# Altium schematic sheet Top Layer.SchDoc
size 508 x 508 mm; SPICEModelCacheOYVUHRHD: <root> / <DocumentId>OYVUHRHD</DocumentId> / <CacheFrame Number="0"> / <Model Name="zener" Kind="MDL"> / <Text>*ZENER / *Default Zener 10V @ 10mA / *Zener Diode Pinout: A,K / .MODEL ZENER D( BV=10 IBV=10E-3 )</Text> / </Model> / <Model Name="cap" Kind="MDL"> / <Text>*Default semiconductor capacitor / .MODEL CAP C()</Text> / </Model> / </CacheFrame> / </root>
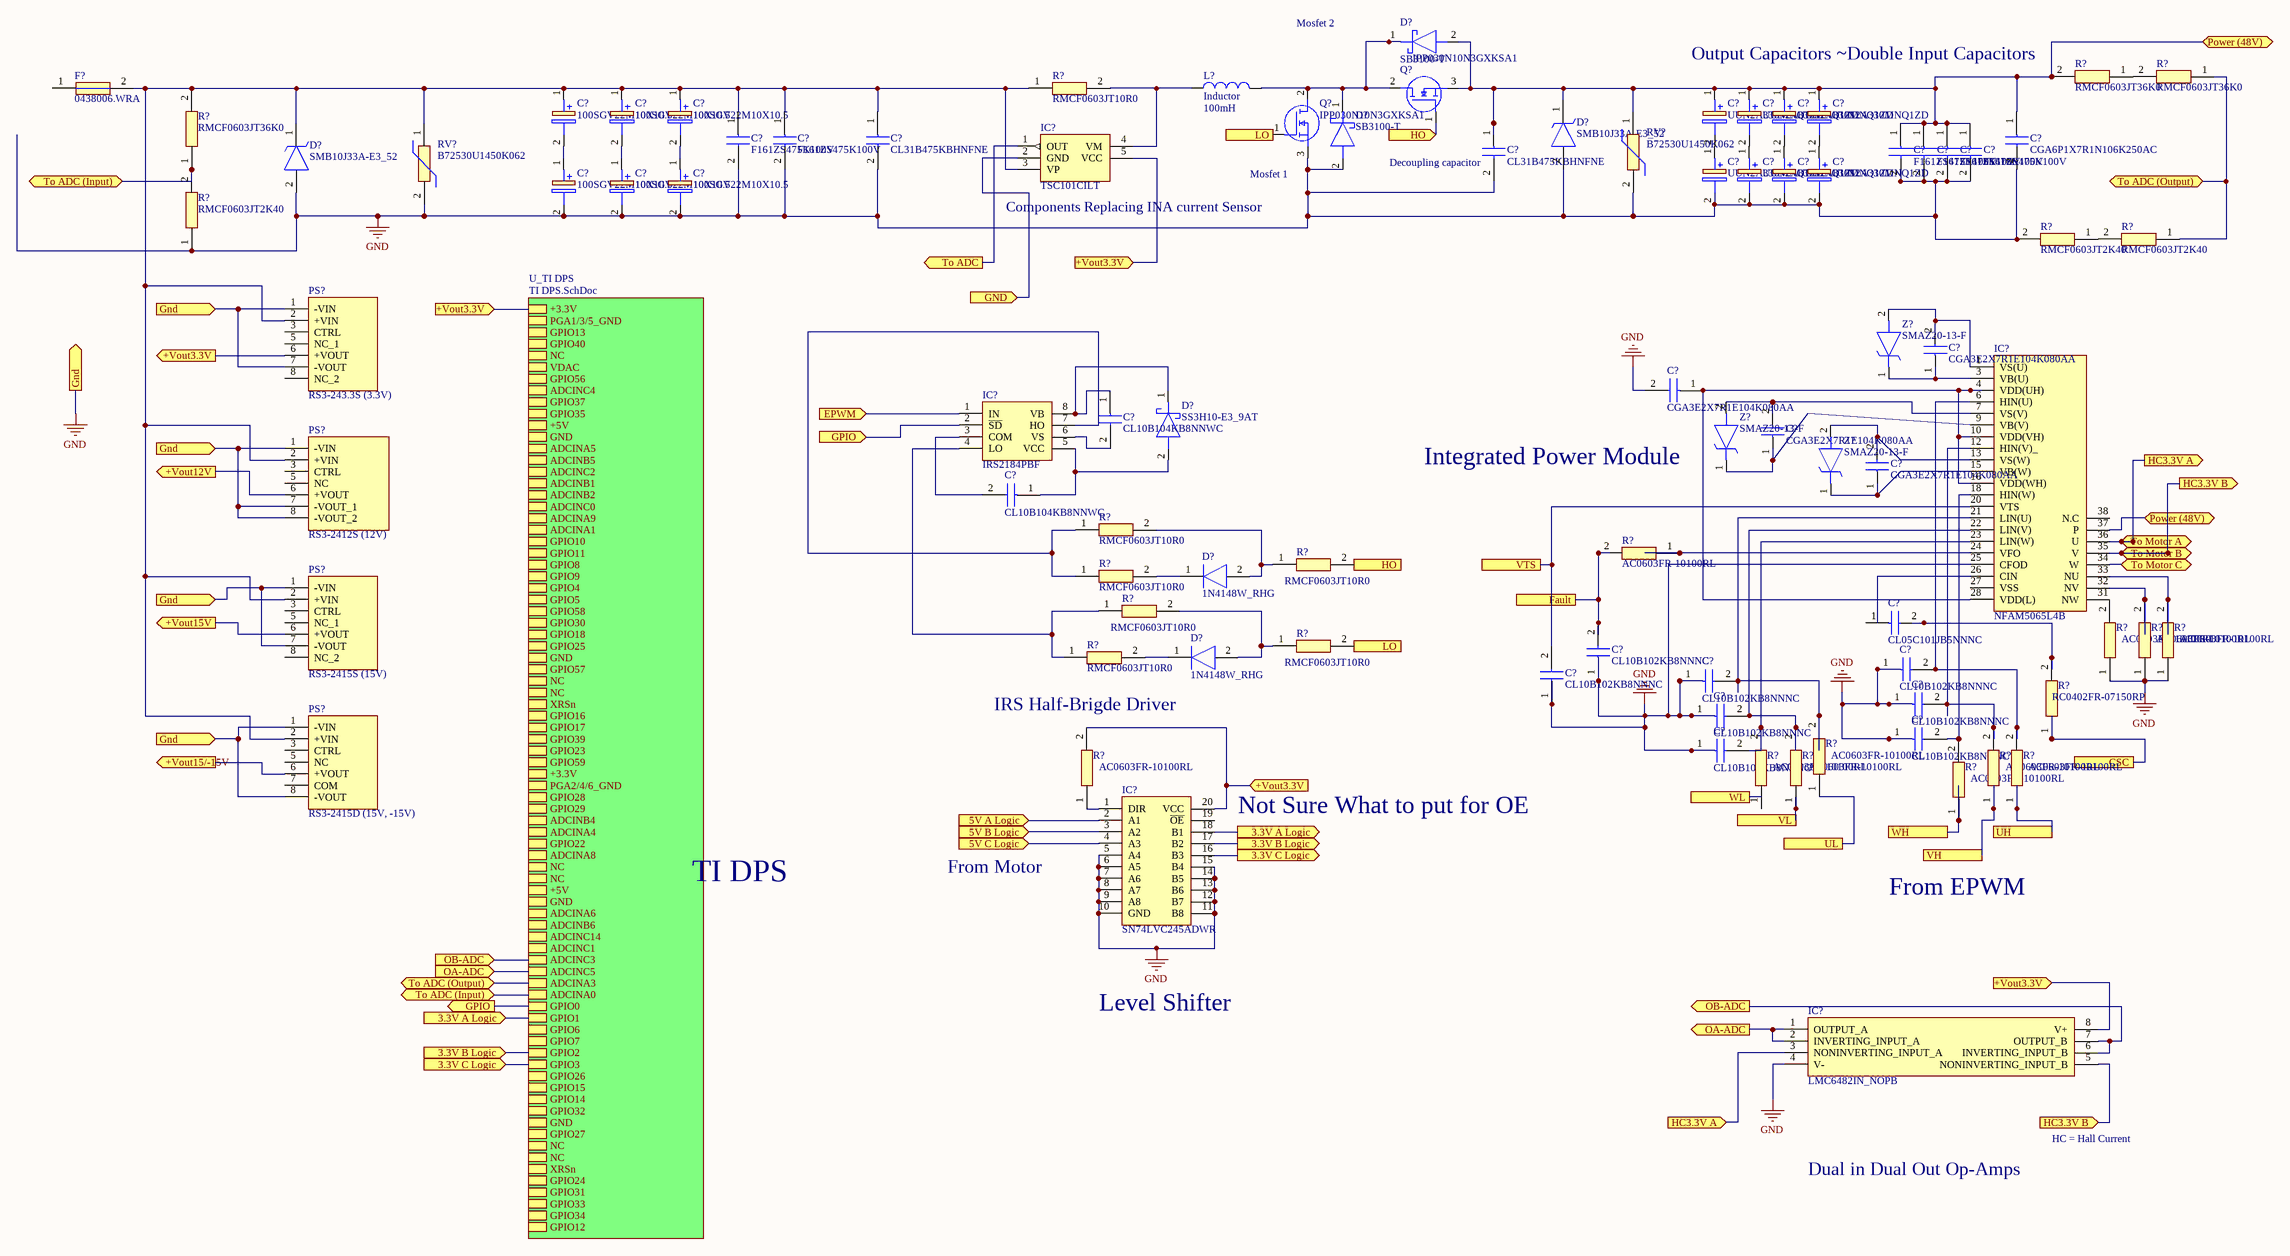
[diagram p0: Top Layer.SchDoc]

## Parts
(Parts that share a designator on the sheet are numbered #1, #2 ... from top to bottom, then left to right.)
C?#1  100SGV22M10X10.5  [CAPAE1030X1050N]
C?#2  100SGV22M10X10.5  [CAPAE1030X1050N]
C?#3  100SGV22M10X10.5  [CAPAE1030X1050N]
C?#4  UUN2A330MNQ1ZD  [CAPAE1360X1700N]
C?#5  UUN2A330MNQ1ZD  [CAPAE1360X1700N]
C?#6  UUN2A330MNQ1ZD  [CAPAE1360X1700N]
C?#7  UUN2A330MNQ1ZD  [CAPAE1360X1700N]
C?#8  F161ZS475K100V  [CAPC165150X720N]
C?#9  F161ZS475K100V  [CAPC165150X720N]
C?#10  CL31B475KBHNFNE  [CAPC3216X180N]
C?#11  CGA6P1X7R1N106K250AC  [CAPC3225X280N]
C?#12  CL31B475KBHNFNE  [CAPC3216X180N]
C?#13  F161ZS475K100V  [CAPC165150X720N]
C?#14  F161ZS475K100V  [CAPC165150X720N]
C?#15  F161ZS475K100V  [CAPC165150X720N]
C?#16  F161ZS475K100V  [CAPC165150X720N]
C?#17  UUN2A330MNQ1ZD  [CAPAE1360X1700N]
C?#18  UUN2A330MNQ1ZD  [CAPAE1360X1700N]
C?#19  UUN2A330MNQ1ZD  [CAPAE1360X1700N]
C?#20  UUN2A330MNQ1ZD  [CAPAE1360X1700N]
C?#21  100SGV22M10X10.5  [CAPAE1030X1050N]
C?#22  100SGV22M10X10.5  [CAPAE1030X1050N]
C?#23  100SGV22M10X10.5  [CAPAE1030X1050N]
C?#24  CGA3E2X7R1E104K080AA  [CAPC1608X90N]
C?#25  CL10B104KB8NNWC  [CAPC1608X90N]
C?#26  CGA3E2X7R1E104K080AA  [CAPC1608X90N]
C?#27  CGA3E2X7R1E104K080AA  [CAPC1608X90N]
C?#28  CL10B104KB8NNWC  [CAPC1608X90N]
C?#29  CGA3E2X7R1E104K080AA  [CAPC1608X90N]
C?#30  CL05C101JB5NNNC  [CAPC1005X55N]
C?#31  CL10B102KB8NNNC  [CAPC1608X90N]
C?#32  CL10B102KB8NNNC  [CAPC1608X90N]
C?#33  CL10B102KB8NNNC  [CAPC1608X90N]
C?#34  CL10B102KB8NNNC  [CAPC1608X90N]
C?#35  CL10B102KB8NNNC  [CAPC1608X90N]
C?#36  CL10B102KB8NNNC  [CAPC1608X90N]
C?#37  CL10B102KB8NNNC  [CAPC1608X90N]
C?#38  CL10B102KB8NNNC  [CAPC1608X90N]
D?#1  SB3100-T  [DIOAD2855W130L835D505]
D?#2  SB3100-T  [DIOAD2855W130L835D505]
D?#3  SMB10J33A-E3_52  [DIOM5436X244N]
D?#4  SMB10J33A-E3_52  [DIOM5436X244N]
D?#5  SS3H10-E3_9AT  [DIOM7959X262N]
D?#6  1N4148W_RHG  [1N4148WRHG]
D?#7  1N4148W_RHG  [1N4148WRHG]
F?  0438006.WRA  [FUSC1608X61N]
IC?#1  TSC101CILT  [SOT95P280X145-5N]
IC?#2  IRS2184PBF  [DIP762W56P254L988H533Q8N]
IC?#3  NFAM5065L4B  [NFAM5065L4B]
IC?#4  SN74LVC245ADWR  [SOIC127P1030X265-20N]
IC?#5  LMC6482IN_NOPB  [DIP794W53P254L959H508Q8N]
L?  Inductor  value 100mH  [0402-A]
PS?#1  RS3-243.3S (3.3V)  [RS32433S]
PS?#2  RS3-2412S (12V)  [RS3]
PS?#3  RS3-2415S (15V)  [RS32415S]
PS?#4  RS3-2415D (15V, -15V)  [RS31215D]
Q?#1  IPP030N10N3GXKSA1  [TO254P457X1003X2115-3P]
Q?#2  IPP030N10N3GXKSA1  [TO254P457X1003X2115-3P]
R?#1  RMCF0603JT36K0  [RESC1608X55N]
R?#2  RMCF0603JT36K0  [RESC1608X55N]
R?#3  RMCF0603JT10R0  [RESC1608X55N]
R?#4  RMCF0603JT36K0  [RESC1608X55N]
R?#5  RMCF0603JT2K40  [RESC1608X55N]
R?#6  RMCF0603JT2K40  [RESC1608X55N]
R?#7  RMCF0603JT2K40  [RESC1608X55N]
R?#8  RMCF0603JT10R0  [RESC1608X55N]
R?#9  AC0603FR-10100RL  [RESC1608X55N]
R?#10  RMCF0603JT10R0  [RESC1608X55N]
R?#11  RMCF0603JT10R0  [RESC1608X55N]
R?#12  RMCF0603JT10R0  [RESC1608X55N]
R?#13  RMCF0603JT10R0  [RESC1608X55N]
R?#14  RMCF0603JT10R0  [RESC1608X55N]
R?#15  AC0603FR-10100RL  [RESC1608X55N]
R?#16  AC0603FR-10100RL  [RESC1608X55N]
R?#17  AC0603FR-10100RL  [RESC1608X55N]
R?#18  RC0402FR-07150RP  [RESC1005X40N]
R?#19  AC0603FR-10100RL  [RESC1608X55N]
R?#20  AC0603FR-10100RL  [RESC1608X55N]
R?#21  AC0603FR-10100RL  [RESC1608X55N]
R?#22  AC0603FR-10100RL  [RESC1608X55N]
R?#23  AC0603FR-10100RL  [RESC1608X55N]
R?#24  AC0603FR-10100RL  [RESC1608X55N]
R?#25  AC0603FR-10100RL  [RESC1608X55N]
RV?#1  B72530U1450K062  [VARC3225X275N]
RV?#2  B72530U1450K062  [VARC3225X275N]
Z?#1  SMAZ20-13-F  [DIOM5226X240N]
Z?#2  SMAZ20-13-F  [DIOM5226X240N]
Z?#3  SMAZ20-13-F  [DIOM5226X240N]

## Sub-sheets
U_TI DPS = TI DPS.SchDoc: +3.3V, PGA1/3/5_GND, GPIO13, GPIO40, NC, VDAC, GPIO56, ADCINC4, GPIO37, GPIO35, +5V, GND, ADCINA5, ADCINB5, ADCINC2, ADCINB1, ADCINB2, ADCINC0, ADCINA9, ADCINA1, GPIO10, GPIO11, GPIO8, GPIO9, GPIO4, GPIO5, GPIO58, GPIO30, GPIO18, GPIO25, GND, GPIO57, NC, NC, XRSn, GPIO16, GPIO17, GPIO39, GPIO23, GPIO59, +3.3V, PGA2/4/6_GND, GPIO28, GPIO29, ADCINB4, ADCINA4, GPIO22, ADCINA8, NC, NC, +5V, GND, ADCINA6, ADCINB6, ADCINC14, ADCINC1, ADCINC3, ADCINC5, ADCINA3, ADCINA0, GPIO0, GPIO1, GPIO6, GPIO7, GPIO2, GPIO3, GPIO26, GPIO15, GPIO14, GPIO32, GND, GPIO27, NC, NC, XRSn, GPIO24, GPIO31, GPIO33, GPIO34, GPIO12

## Ports
3.3V A Logic (in), 3.3V A Logic (out), 3.3V B Logic (in), 3.3V B Logic (out), 3.3V C Logic (in), 3.3V C Logic (out), 5V A Logic (in), 5V B Logic (in), 5V C Logic (in), +Vout3.3V (in), +Vout3.3V (out), +Vout12V (out), +Vout15/-15V (out), +Vout15V (out), CSC, EPWM (in), Fault, Gnd (in), GND (in), Gnd (out), GPIO (in), GPIO (out), HC3.3V A (in), HC3.3V A (out), HC3.3V B (in), HC3.3V B (out), HO (in), HO (out), LO (in), LO (out), OA-ADC (in), OA-ADC (out), OB-ADC (in), OB-ADC (out), Power (48V) (bidir), To ADC (Input) (bidir), To ADC (out), To ADC (Output) (bidir), To Motor A (bidir), To Motor B (bidir), To Motor C (bidir), UH, UL, VH, VL, VTS, WH, WL

## Nets
GND: C?#8.2 C?#9.2 C?#10.2 C?#11.2 C?#12.2 C?#13.2 C?#14.2 C?#15.2 C?#16.2 C?#17.2(-) C?#18.2(-) C?#19.2(-) C?#20.2(-) C?#21.2(-) C?#22.2(-) C?#23.2(-) C?#26.2 C?#31.1 C?#32.1 C?#33.1 C?#34.1 C?#35.1 C?#36.1 C?#37.1 C?#38.1 D?#2.2(A) D?#3.2(A) D?#4.2(A) IC?#1.2(GND) IC?#3.25(CFOD) IC?#4.5(A4) IC?#4.6(A5) IC?#4.7(A6) IC?#4.8(A7) IC?#4.9(A8) IC?#4.10(GND) IC?#4.11(B8) IC?#4.12(B7) IC?#4.13(B6) IC?#4.14(B5) IC?#4.15(B4) IC?#5.4(V-) PS?#1.1(-VIN) PS?#1.7(-VOUT) PS?#2.1(-VIN) PS?#2.7(-VOUT_1) PS?#2.8(-VOUT_2) PS?#3.1(-VIN) PS?#3.7(-VOUT) PS?#4.1(-VIN) PS?#4.8(-VOUT) Q?#2.3(S) R?#5.2 R?#7.1 R?#15.1 R?#16.1 R?#17.1 RV?#1.2 RV?#2.2 ; port Gnd, port GND
3.3V A Logic: IC?#4.18(B1) ; port 3.3V A Logic, sheet U_TI DPS/GPIO1
3.3V B Logic: IC?#4.17(B2) ; port 3.3V B Logic, sheet U_TI DPS/GPIO2
3.3V C Logic: IC?#4.16(B3) ; port 3.3V C Logic, sheet U_TI DPS/GPIO3
5V A Logic: IC?#4.2(A1) ; port 5V A Logic
5V B Logic: IC?#4.3(A2) ; port 5V B Logic
5V C Logic: IC?#4.4(A3) ; port 5V C Logic
+Vout3.3V: IC?#1.5(VCC) IC?#4.20(VCC) IC?#5.8(V+) PS?#1.6(+VOUT) R?#20.2 ; port +Vout3.3V, sheet U_TI DPS/+3.3V
+Vout12V: PS?#2.6(+VOUT) ; port +Vout12V
+Vout15/-15V: PS?#4.6(+VOUT) ; port +Vout15/-15V
+Vout15V: PS?#3.6(+VOUT) ; port +Vout15V
CSC: R?#18.1 ; port CSC
EPWM: IC?#2.1(IN) ; port EPWM
Fault: C?#32.2 R?#9.2 ; port Fault
GPIO: IC?#2.2(~{SD}) ; port GPIO, sheet U_TI DPS/GPIO0
HC3.3V A: IC?#3.36(U) IC?#5.3(NONINVERTING_INPUT_A) ; port HC3.3V A, port To Motor A
HC3.3V B: IC?#3.35(V) IC?#5.5(NONINVERTING_INPUT_B) ; port HC3.3V B, port To Motor B
HO: Q?#1.1(G) R?#10.2 ; port HO
LO: Q?#2.1(G) R?#13.2 ; port LO
OA-ADC: IC?#5.1(OUTPUT_A) IC?#5.2(INVERTING_INPUT_A) ; port OA-ADC, sheet U_TI DPS/ADCINC5
OB-ADC: IC?#5.6(INVERTING_INPUT_B) IC?#5.7(OUTPUT_B) ; port OB-ADC, sheet U_TI DPS/ADCINC3
Power (48V): C?#4.1(+) C?#5.1(+) C?#6.1(+) C?#7.1(+) C?#11.1 C?#12.1 C?#13.1 C?#14.1 C?#15.1 C?#16.1 D?#1.2(A) D?#3.1(K) IC?#3.37(P) Q?#1.3(S) R?#1.2 RV?#1.1 ; port Power (48V)
To ADC: IC?#1.1(OUT) ; port To ADC
To ADC (Input): R?#4.1 R?#7.2 ; port To ADC (Input), sheet U_TI DPS/ADCINA0
To ADC (Output): R?#2.1 R?#6.1 ; port To ADC (Output), sheet U_TI DPS/ADCINA3
To Motor C: IC?#3.34(W) ; port To Motor C
UH: R?#24.1 ; port UH
UL: R?#19.1 ; port UL
VH: R?#23.1 ; port VH
VL: R?#22.1 ; port VL
VTS: C?#34.2 IC?#3.20(VTS) ; port VTS
WH: R?#25.1 ; port WH
NetC?#1_1: C?#1.1(+) C?#2.1(+) C?#3.1(+) C?#8.1 C?#9.1 C?#10.1 D?#4.1(K) F?.2 IC?#1.3(VP) PS?#1.2(+VIN) PS?#2.2(+VIN) PS?#3.2(+VIN) PS?#4.2(+VIN) R?#3.1 R?#4.2 RV?#2.1
NetC?#1_2: C?#1.2(-) C?#21.1(+)
NetC?#2_2: C?#2.2(-) C?#22.1(+)
NetC?#3_2: C?#3.2(-) C?#23.1(+)
NetC?#4_2: C?#4.2(-) C?#17.1(+)
NetC?#5_2: C?#5.2(-) C?#18.1(+)
NetC?#6_2: C?#6.2(-) C?#19.1(+)
NetC?#7_2: C?#7.2(-) C?#20.1(+)
NetC?#24_1: C?#24.1 IC?#3.3(VB(U)) Z?#1.1(K)
NetC?#24_2: C?#24.2 IC?#3.1(VS(U)) Z?#1.2(A)
NetC?#25_1: C?#25.1 D?#5.1(K) IC?#2.8(VB)
NetC?#25_2: C?#25.2 IC?#2.6(VS)
NetC?#26_1: C?#26.1 IC?#3.4(VDD(UH)) IC?#3.10(VDD(VH)) IC?#3.16(VDD(WH)) IC?#3.28(VDD(L))
NetC?#27_1: C?#27.1 IC?#3.9(VB(V)) Z?#2.1(K)
NetC?#27_2: C?#27.2 IC?#3.7(VS(V)) Z?#2.2(A)
NetC?#28_1: C?#28.1 D?#5.2(A) IC?#2.5(VCC)
NetC?#28_2: C?#28.2 IC?#2.3(COM)
NetC?#29_1: C?#29.1 IC?#3.15(VB(W)) Z?#3.1(K)
NetC?#29_2: C?#29.2 IC?#3.13(VS(W)) Z?#3.2(A)
NetC?#30_2: C?#30.2 R?#18.2
NetC?#31_2: C?#31.2 IC?#3.6(HIN(U)) R?#24.2
NetC?#33_2: C?#33.2 IC?#3.21(LIN(U)) R?#19.2
NetC?#35_2: C?#35.2 IC?#3.12(HIN(V)_) R?#23.2
NetC?#36_2: C?#36.2 IC?#3.22(LIN(V)) R?#22.2
NetC?#37_2: C?#37.2 IC?#3.18(HIN(W)) R?#25.2
NetC?#38_2: C?#38.2 IC?#3.23(LIN(W)) R?#21.2
NetD?#1_1: D?#1.1(K) D?#2.1(K) L?.2 Q?#1.2(D) Q?#2.2(D)
NetD?#6_1: D?#6.1(K) R?#11.2
NetD?#6_2: D?#6.2(A) R?#8.2 R?#10.1
NetD?#7_1: D?#7.1(K) R?#14.2
NetD?#7_2: D?#7.2(A) R?#12.2 R?#13.1
NetIC?#1_4: IC?#1.4(VM) L?.1 R?#3.2
NetIC?#2_4: IC?#2.4(LO) R?#12.1 R?#14.1
NetIC?#2_7: IC?#2.7(HO) R?#8.1 R?#11.1
NetIC?#3_24: IC?#3.24(VFO) R?#9.1
NetIC?#3_31: IC?#3.31(NW) R?#15.2
NetIC?#3_32: IC?#3.32(NV) R?#16.2
NetIC?#3_33: IC?#3.33(NU) R?#17.2
NetIC?#4_1: IC?#4.1(DIR) R?#20.1
NetR?#1_1: R?#1.1 R?#2.2
NetR?#5_1: R?#5.1 R?#6.2

Not connected (* = marked no-connect by the designer): C?#30 1; F? 1; IC?#3 26(CIN) 27(VSS) 38(N.C); IC?#4 19(~{OE}); PS?#1 3(CTRL) 5(NC_1) 8(NC_2); PS?#2 3(CTRL) 5(NC); PS?#3 3(CTRL) 5(NC_1) 8(NC_2); PS?#4 3(CTRL) 5(NC) 7(COM); R?#21 1

## Notes on the sheet
- Mosfet 2
- (near R?#1) Output Capacitors ~Double Input Capacitors
- (near Q?#2) Mosfet 1
- (near C?#12) Decoupling capacitor
- (near IC?#1) Components Replacing INA current Sensor
- (near Z?#2) Integrated Power Module
- IRS Half-Brigde Driver
- Not Sure What to put for OE
- TI DPS
- From Motor
- From EPWM
- Level Shifter
- Dual in Dual Out Op-Amps
- HC = Hall Current

## Library data of the parts
C?#1-C?#3 C?#21-C?#23 = 100SGV22M10X10.5: Capacitor Polarised; Manufacturer_Name: Rubycon; Datasheet Link: https://datasheet.lcsc.com/szlcsc/2004151135_Rubycon-100SGV22M10X10-5_C473179.pdf; Height: 10.5mm; Manufacturer_Part_Number: 100SGV22M10X10.5
C?#4-C?#7 C?#17-C?#20 = UUN2A330MNQ1ZD: Capacitor Polarised; Manufacturer_Name: Nichicon; Datasheet Link: https://eu.mouser.com/datasheet/2/293/e_uun-1513030.pdf; Height: 17mm; Manufacturer_Part_Number: UUN2A330MNQ1ZD; Mouser Part Number: 647-UUN2A330MNQ1ZD; Mouser Price/Stock: https://www.mouser.co.uk/ProductDetail/Nichicon/UUN2A330MNQ1ZD?qs=foqSp1HUgzuU3Z512SGJSw%3D%3D
C?#8 C?#9 C?#13-C?#16 = F161ZS475K100V: Capacitor; Manufacturer_Name: KEMET; Datasheet Link: https://api.kemet.com/component-edge/download/datasheet/F161ZS475K100V.pdf; Height: 7.2mm; Manufacturer_Part_Number: F161ZS475K100V; Mouser Part Number: 80-F161ZS475K100V; Mouser Price/Stock: https://www.mouser.co.uk/ProductDetail/KEMET/F161ZS475K100V?qs=UljWRoG%252BxciJHBVnb319nw%3D%3D
C?#10 C?#12 = CL31B475KBHNFNE: Capacitor; Manufacturer_Name: Samsung Electro-Mechanics; Datasheet Link: https://datasheet.datasheetarchive.com/originals/dk/DKDS-19/375360.pdf; Height: 1.8mm; Manufacturer_Part_Number: CL31B475KBHNFNE; Mouser Part Number: N/A; Mouser Price/Stock: https://www.mouser.com/Search/Refine.aspx?Keyword=N%2FA; Arrow Part Number: CL31B475KBHNFNE; Arrow Price/Stock: https://www.arrow.com/en/products/cl31b475kbhnfne/samsung-electro-mechanics
C?#11 = CGA6P1X7R1N106K250AC: Capacitor; Manufacturer_Name: TDK; Datasheet Link: https://product.tdk.com/system/files/dam/doc/product/capacitor/ceramic/mlcc/catalog/mlcc_automotive_general_en.pdf; Height: 2.8mm; Manufacturer_Part_Number: CGA6P1X7R1N106K250AC; Mouser Part Number: 810-CGA6P1X7R1N106K2; Mouser Price/Stock: https://www.mouser.co.uk/ProductDetail/TDK/CGA6P1X7R1N106K250AC?qs=PzGy0jfpSMuJjJ6Wlu9qRA%3D%3D; Arrow Part Number: CGA6P1X7R1N106K250AC; Arrow Price/Stock: https://www.arrow.com/en/products/cga6p1x7r1n106k250ac/tdk?region=europe
C?#24 C?#26 C?#27 C?#29 = CGA3E2X7R1E104K080AA: Capacitor; Manufacturer_Name: TDK; Datasheet Link: https://product.tdk.com/system/files/dam/doc/product/capacitor/ceramic/mlcc/catalog/mlcc_automotive_general_en.pdf; Height: 0.9mm; Manufacturer_Part_Number: CGA3E2X7R1E104K080AA; Mouser Part Number: 810-CGA3E2X7R1E104K; Mouser Price/Stock: https://www.mouser.co.uk/ProductDetail/TDK/CGA3E2X7R1E104K080AA?qs=NRhsANhppD%2Fm7%2FOmmsm0vg%3D%3D; Arrow Part Number: CGA3E2X7R1E104K080AA; Arrow Price/Stock: https://www.arrow.com/en/products/cga3e2x7r1e104k080aa/tdk
C?#25 C?#28 = CL10B104KB8NNWC: Capacitor; Manufacturer_Name: Samsung Electro-Mechanics; Datasheet Link: http://www.samsungsem.com/kr/support/product-search/mlcc/CL10B104KB8NNWC.jsp; Height: 0.9mm; Manufacturer_Part_Number: CL10B104KB8NNWC; Mouser Part Number: 187-CL10B104KB8NNWC; Mouser Price/Stock: https://www.mouser.co.uk/ProductDetail/Samsung-Electro-Mechanics/CL10B104KB8NNWC?qs=EvNa9vf1TdYOAZGBJN%252BGRQ%3D%3D; Arrow Part Number: CL10B104KB8NNWC; Arrow Price/Stock: https://www.arrow.com/en/products/cl10b104kb8nnwc/samsung-electro-mechanics
C?#30 = CL05C101JB5NNNC: Capacitor; Manufacturer_Name: Samsung Electro-Mechanics; Datasheet Link: https://4donline.ihs.com/images/VipMasterIC/IC/SEMS/SEMS-S-A0008529205/SEMS-S-A0008529205-1.pdf?hkey=EF798316E3902B6ED9A73243A3159BB0; Height: 0.55mm; Manufacturer_Part_Number: CL05C101JB5NNNC; Mouser Part Number: 187-CL05C101JB5NNNC; Mouser Price/Stock: https://www.mouser.co.uk/ProductDetail/Samsung-Electro-Mechanics/CL05C101JB5NNNC?qs=349EhDEZ59paexK6JjA00Q%3D%3D; Arrow Part Number: CL05C101JB5NNNC; Arrow Price/Stock: https://www.arrow.com/en/products/cl05c101jb5nnnc/samsung-electro-mechanics?region=europe
C?#31-C?#38 = CL10B102KB8NNNC: Capacitor; Manufacturer_Name: Samsung Electro-Mechanics; Datasheet Link: https://componentsearchengine.com/Datasheets/2/CL10B102KB8NNNC.pdf; Height: 0.9mm; Manufacturer_Part_Number: CL10B102KB8NNNC; Mouser Part Number: 187-CL10B102KB8NNNC; Mouser Price/Stock: https://www.mouser.co.uk/ProductDetail/Samsung-Electro-Mechanics/CL10B102KB8NNNC?qs=349EhDEZ59ooQTCVhaHrjw%3D%3D; Arrow Part Number: CL10B102KB8NNNC; Arrow Price/Stock: https://www.arrow.com/en/products/cl10b102kb8nnnc/samsung-electro-mechanics?region=nac
D?#1 D?#2 = SB3100-T: Schottky Diode; Manufacturer_Name: Diodes Inc.; Datasheet Link: https://www.arrow.com/en/products/sb3100-t/diodes-incorporated; Manufacturer_Part_Number: SB3100-T; Mouser Part Number: 621-SB3100-T; Mouser Price/Stock: https://www.mouser.co.uk/ProductDetail/Diodes-Incorporated/SB3100-T?qs=sxN%252BoM2fis%2FAgcaQZ%2FblUQ%3D%3D; Arrow Part Number: SB3100-T; Arrow Price/Stock: https://www.arrow.com/en/products/sb3100-t/diodes-incorporated
D?#3 D?#4 = SMB10J33A-E3_52: TVS Diode (Uni-directional); Manufacturer_Name: Vishay; Manufacturer_Part_Number: SMB10J33A-E3/52; Datasheet Link: https://datasheet.datasheetarchive.com/originals/distributors/Datasheets-DGA26/1848072.pdf; Height: 2.44mm
D?#5 = SS3H10-E3_9AT: Schottky Diode; Manufacturer_Name: Vishay; Manufacturer_Part_Number: SS3H10-E3/9AT; Datasheet Link: https://componentsearchengine.com/Datasheets/2/SS3H10-E3_9AT.pdf; Height: 2.62mm; Mouser Part Number: 625-SS3H10-E3/9AT; Mouser Price/Stock: https://www.mouser.co.uk/ProductDetail/Vishay-General-Semiconductor/SS3H10-E3-9AT?qs=x2jpVgRnAtOgVt1hh%2FtmvQ%3D%3D; Arrow Part Number: SS3H10-E3/9AT; Arrow Price/Stock: https://www.arrow.com/en/products/ss3h10-e39at/vishay
D?#6 D?#7 = 1N4148W_RHG: Diode; Manufacturer_Name: Taiwan Semiconductor; Manufacturer_Part_Number: 1N4148W RHG; Datasheet Link: https://mouser.componentsearchengine.com/Datasheets/1/1N4148W RHG.pdf; Height: 1.15mm; Mouser Part Number: 821-1N4148WRHG; Mouser Price/Stock: https://www.mouser.co.uk/ProductDetail/Taiwan-Semiconductor/1N4148W-RHG?qs=KwaGCOX4wIag2YPLXylAvA%3D%3D; Arrow Part Number: 1N4148W RHG; Arrow Price/Stock: https://www.arrow.com/en/products/1n4148wrhg/taiwan-semiconductor?region=nac
F? = 0438006.WRA: Fuse; Manufacturer_Name: LITTELFUSE; Datasheet Link: https://m.littelfuse.com/~/media/electronics/datasheets/fuses/littelfuse_fuse_438a_datasheet.pdf.pdf; Height: 0.61mm; Manufacturer_Part_Number: 0438006.WRA; Mouser Part Number: 576-0438006.WRA; Mouser Price/Stock: https://www.mouser.co.uk/ProductDetail/Littelfuse/0438006WRA/?qs=wd5RIQLrsJgGoLfo6b27hA%3D%3D; Arrow Part Number: 0438006.WRA; Arrow Price/Stock: https://www.arrow.com/en/products/0438006.wra/littelfuse
IC?#1 = TSC101CILT: Integrated Circuit; Manufacturer_Name: STMicroelectronics; Datasheet Link: http://www.st.com/st-web-ui/static/active/en/resource/technical/document/datasheet/CD00153725.pdf; Height: 1.45mm; Manufacturer_Part_Number: TSC101CILT; Mouser Part Number: 511-TSC101CILT; Mouser Price/Stock: https://www.mouser.co.uk/ProductDetail/STMicroelectronics/TSC101CILT?qs=lcekmG%2FW9sxmlDsaowrHVg%3D%3D; Arrow Part Number: TSC101CILT; Arrow Price/Stock: https://www.arrow.com/en/products/tsc101cilt/stmicroelectronics
IC?#2 = IRS2184PBF: Integrated Circuit; Manufacturer_Name: Infineon; Datasheet Link: http://uk.rs-online.com/web/p/products/0456214; Height: 5.33mm; Manufacturer_Part_Number: IRS2184PBF; Mouser Part Number: 942-IRS2184PBF; Mouser Price/Stock: https://www.mouser.co.uk/ProductDetail/Infineon-Technologies/IRS2184PBF?qs=9%252BKlkBgLFf3%2F4k8XP8%252BWIw%3D%3D; Arrow Part Number: IRS2184PBF; Arrow Price/Stock: https://www.arrow.com/en/products/irs2184pbf/infineon-technologies-ag?region=nac
IC?#3 = NFAM5065L4B: Integrated Circuit; Manufacturer_Name: ON Semiconductor; Datasheet Link: https://www.onsemi.com/pub/Collateral/NFAM5065L4B-D.PDF; Height: 5.7mm; Manufacturer_Part_Number: NFAM5065L4B; Mouser Part Number: 863-NFAM5065L4B; Mouser Price/Stock: https://www.mouser.co.uk/ProductDetail/ON-Semiconductor/NFAM5065L4B?qs=XeJtXLiO41S6EjucZAfhuA%3D%3D
IC?#4 = SN74LVC245ADWR: Integrated Circuit; Manufacturer_Name: Texas Instruments; Datasheet Link: http://www.ti.com/general/docs/suppproductinfo.tsp?distId=10&gotoUrl=http%3A%2F%2Fwww.ti.com%2Flit%2Fgpn%2Fsn74lvc245a; Height: 2.65mm; Manufacturer_Part_Number: SN74LVC245ADWR; Mouser Part Number: 595-SN74LVC245ADWR; Mouser Price/Stock: https://www.mouser.co.uk/ProductDetail/Texas-Instruments/SN74LVC245ADWR?qs=WzgTT80quPGdOFCXqni3uA%3D%3D; Arrow Part Number: SN74LVC245ADWR; Arrow Price/Stock: https://www.arrow.com/en/products/sn74lvc245adwr/texas-instruments?region=nac
IC?#5 = LMC6482IN_NOPB: Integrated Circuit; Manufacturer_Name: Texas Instruments; Manufacturer_Part_Number: LMC6482IN/NOPB; Datasheet Link: http://www.ti.com/lit/gpn/lmc6482; Height: 5.08mm; Mouser Part Number: 926-LMC6482IN/NOPB; Mouser Price/Stock: https://www.mouser.co.uk/ProductDetail/Texas-Instruments/LMC6482IN-NOPB?qs=QbsRYf82W3EByDDrj8Vijg%3D%3D; Arrow Part Number: LMC6482IN/NOPB; Arrow Price/Stock: https://www.arrow.com/en/products/lmc6482innopb/texas-instruments?region=nac
L? = Inductor: Code_IEC: 1005; Published: 8-Jun-2000; LatestRevisionDate: 29-May-2009; LatestRevisionNote: IPC-7351 Footprint Added.; PackageReference: 0402-A; Publisher: Altium Limited; PackageDescription: Chip Inductor; Code_JEITA: 0402
PS?#1 = RS3-243.3S: Power Supply; Manufacturer_Name: RECOM Power; Datasheet Link: https://www.arrow.com/en/products/rs3-243.3s/recom-power; Height: 11.35mm; Manufacturer_Part_Number: RS3-243.3S; Mouser Part Number: 919-RS3-243.3S; Mouser Price/Stock: https://www.mouser.com/Search/Refine.aspx?Keyword=919-RS3-243.3S; Arrow Part Number: RS3-243.3S; Arrow Price/Stock: https://www.arrow.com/en/products/rs3-243.3s/recom-power
PS?#2 = RS3-2412S: Power Supply; Manufacturer_Name: RECOM Power; Datasheet Link: https://www.recom-power.com/pdf/Econoline/RS3-S_D_Z.pdf; Manufacturer_Part_Number: RS3-2412S; Mouser Part Number: 919-RS3-2412S; Mouser Price/Stock: https://www.mouser.co.uk/ProductDetail/RECOM-Power/RS3-2412S?qs=8OBu2JtKQqoMq12sMjx6jQ%3D%3D; Arrow Part Number: RS3-2412S; Arrow Price/Stock: https://www.arrow.com/en/products/rs3-2412s/recom-power?region=nac
PS?#3 = RS3-2415S: Power Supply; Manufacturer_Name: RECOM Power; Datasheet Link: https://www.recom-power.com/pdf/Econoline/RS3-S_D_Z.pdf; Height: 11.35mm; Manufacturer_Part_Number: RS3-2415S; Mouser Part Number: 919-RS3-2415S; Mouser Price/Stock: https://www.mouser.com/Search/Refine.aspx?Keyword=919-RS3-2415S
PS?#4 = RS3-2415D: Power Supply; Manufacturer_Name: RECOM Power; Datasheet Link: https://www.recom-power.com/pdf/Econoline/RS3-S_D_Z.pdf; Height: 11.6mm; Manufacturer_Part_Number: RS3-2415D; Mouser Part Number: 919-RS3-2415D; Mouser Price/Stock: https://www.mouser.co.uk/ProductDetail/RECOM-Power/RS3-2415D?qs=8OBu2JtKQqqT%2FgDxrHvRWg%3D%3D; Arrow Part Number: RS3-2415D; Arrow Price/Stock: https://www.arrow.com/en/products/rs3-2415d/recom-power
Q?#1 Q?#2 = IPP030N10N3GXKSA1: MOSFET (N-Channel); Manufacturer_Name: Infineon; Datasheet Link: https://datasheet.datasheetarchive.com/originals/dk/DKDS-30/599918.pdf; Height: 4.57mm; Manufacturer_Part_Number: IPP030N10N3GXKSA1; Mouser Part Number: 726-IPP030N10N3GXKSA; Mouser Price/Stock: https://www.mouser.co.uk/ProductDetail/Infineon-Technologies/IPP030N10N3GXKSA1?qs=Dj8dEyEphkPNYs%2FCp7xECw%3D%3D; Arrow Part Number: IPP030N10N3GXKSA1; Arrow Price/Stock: https://www.arrow.com/en/products/ipp030n10n3gxksa1/infineon-technologies-ag
R?#1 R?#2 R?#4 = RMCF0603JT36K0: Resistor; Manufacturer_Name: Stackpole Electronics Inc.; Datasheet Link: https://www.seielect.com/Catalog/SEI-RMCF_RMCP.pdf; Height: 0.55mm; Manufacturer_Part_Number: RMCF0603JT36K0
R?#3 R?#8 R?#10-R?#14 = RMCF0603JT10R0: Resistor; Manufacturer_Name: Stackpole Electronics Inc.; Datasheet Link: https://www.seielect.com/catalog/sei-rmcf_rmcp.pdf; Height: 0.55mm; Manufacturer_Part_Number: RMCF0603JT10R0
R?#5-R?#7 = RMCF0603JT2K40: Resistor; Manufacturer_Name: Stackpole Electronics Inc.; Datasheet Link: https://www.seielect.com/catalog/sei-rmcf_rmcp.pdf; Height: 0.55mm; Manufacturer_Part_Number: RMCF0603JT2K40; Arrow Part Number: RMCF0603JT2K40; Arrow Price/Stock: https://www.arrow.com/en/products/rmcf0603jt2k40/stackpole-electronics
R?#9 R?#15-R?#17 R?#19-R?#25 = AC0603FR-10100RL: Resistor; Manufacturer_Name: YAGEO (PHYCOMP); Datasheet Link: https://www.yageo.com/upload/media/product/productsearch/datasheet/rchip/PYu-AC_51_RoHS_L_8.pdf; Height: 0.55mm; Manufacturer_Part_Number: AC0603FR-10100RL; Mouser Part Number: 603-AC0603FR-10100RL; Mouser Price/Stock: https://www.mouser.co.uk/ProductDetail/YAGEO/AC0603FR-10100RL?qs=r5DSvlrkXmIoJQbyrhEywg%3D%3D
R?#18 = RC0402FR-07150RP: Resistor; Manufacturer_Name: YAGEO (PHYCOMP); Datasheet Link: https://www.arrow.com/en/products/rc0402fr-07150rp/yageo; Height: 0.4mm; Manufacturer_Part_Number: RC0402FR-07150RP; Arrow Part Number: RC0402FR-07150RP; Arrow Price/Stock: https://www.arrow.com/en/products/rc0402fr-07150rp/yageo
RV?#1 RV?#2 = B72530U1450K062: Varistor; Manufacturer_Name: TDK; Datasheet Link: https://product.tdk.com/system/files/dam/doc/product/protection/voltage/varistor_ctvs/data_sheet/75/db/ctvs_14/ct1210k45e2g.pdf; Height: 2.75mm; Manufacturer_Part_Number: B72530U1450K062; Mouser Part Number: 871-B72530U1450K062; Mouser Price/Stock: https://www.mouser.co.uk/ProductDetail/EPCOS-TDK/B72530U1450K062?qs=vHuUswq2%252BszHBcenjfcbeQ%3D%3D
Z?#1-Z?#3 = SMAZ20-13-F: Zener Diode; Manufacturer_Name: Diodes Inc.; Datasheet Link: https://www.diodes.com/assets/Datasheets/ds18015.pdf; Height: 2.4mm; Manufacturer_Part_Number: SMAZ20-13-F; Mouser Part Number: 621-SMAZ20-F; Mouser Price/Stock: https://www.mouser.co.uk/ProductDetail/Diodes-Incorporated/SMAZ20-13-F?qs=mGuGFjoQO74YkW4BGqah5A%3D%3D; Arrow Part Number: SMAZ20-13-F; Arrow Price/Stock: https://www.arrow.com/en/products/smaz20-13-f/diodes-incorporated